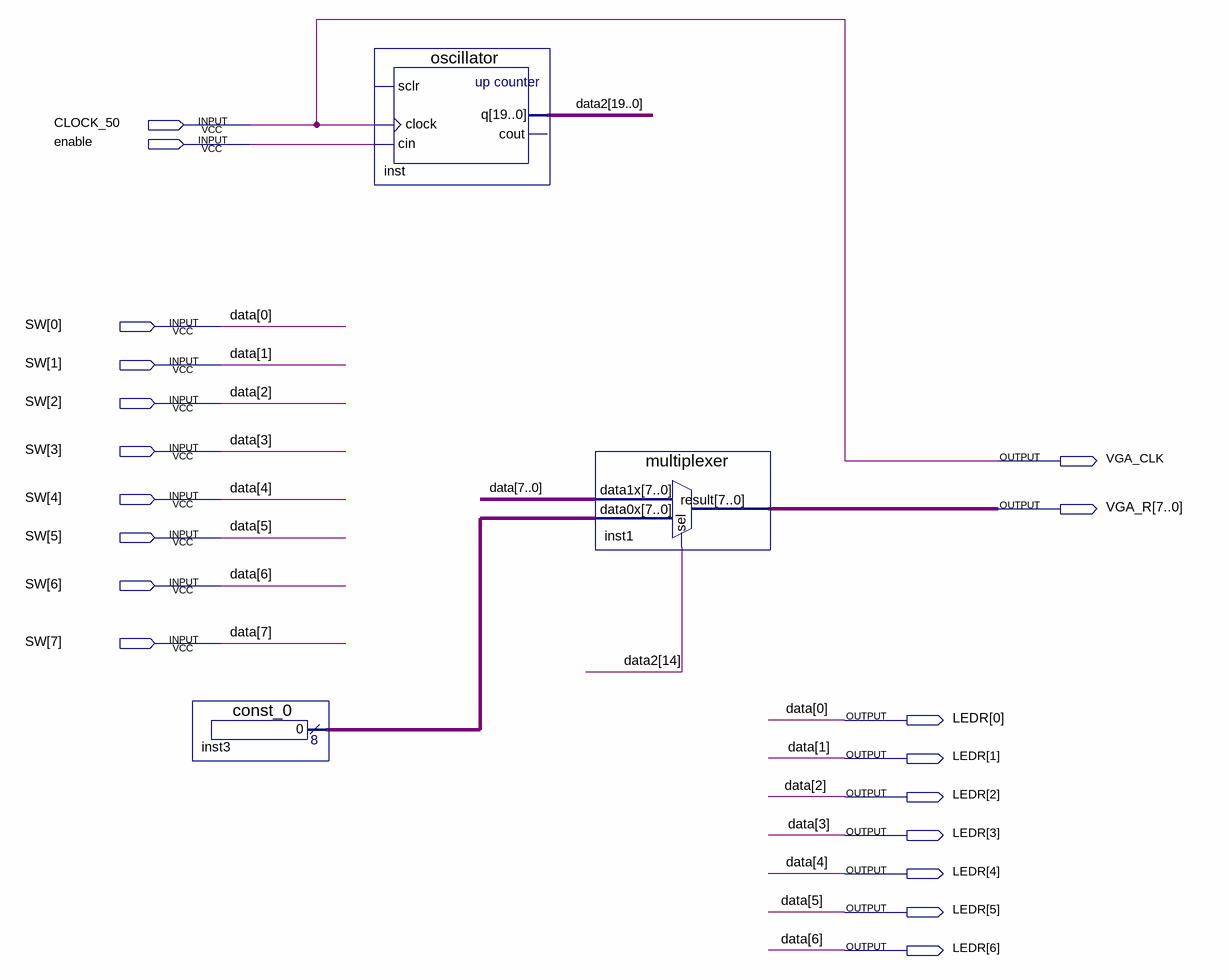
[diagram p0: schematic sheet]
// Quartus schematic TopLevel.bdf as structural Verilog: 3 symbols, 19 pins
module TopLevel (
  input  CLOCK_50,
  input  enable,
  input  [7:0] SW,
  output VGA_CLK,
  output [7:0] VGA_R,
  output [6:0] LEDR
);

  wire [7:0] inst3_result;
  wire [19:0] data2;

  const_0 inst3 (.result(inst3_result));
  oscillator inst (.clock(CLOCK_50), .cin(enable), .q(data2));  // open: sclr, cout
  multiplexer inst1 (.data1x(SW), .data0x(inst3_result), .sel(data2[14]), .result(VGA_R));

  assign LEDR = SW[6:0];
  assign VGA_CLK = CLOCK_50;

  // Other names for the same wires on the sheet: data[7:0] = SW
endmodule
